# EAGLE design ClockDelay (EAGLE 6.6.0)
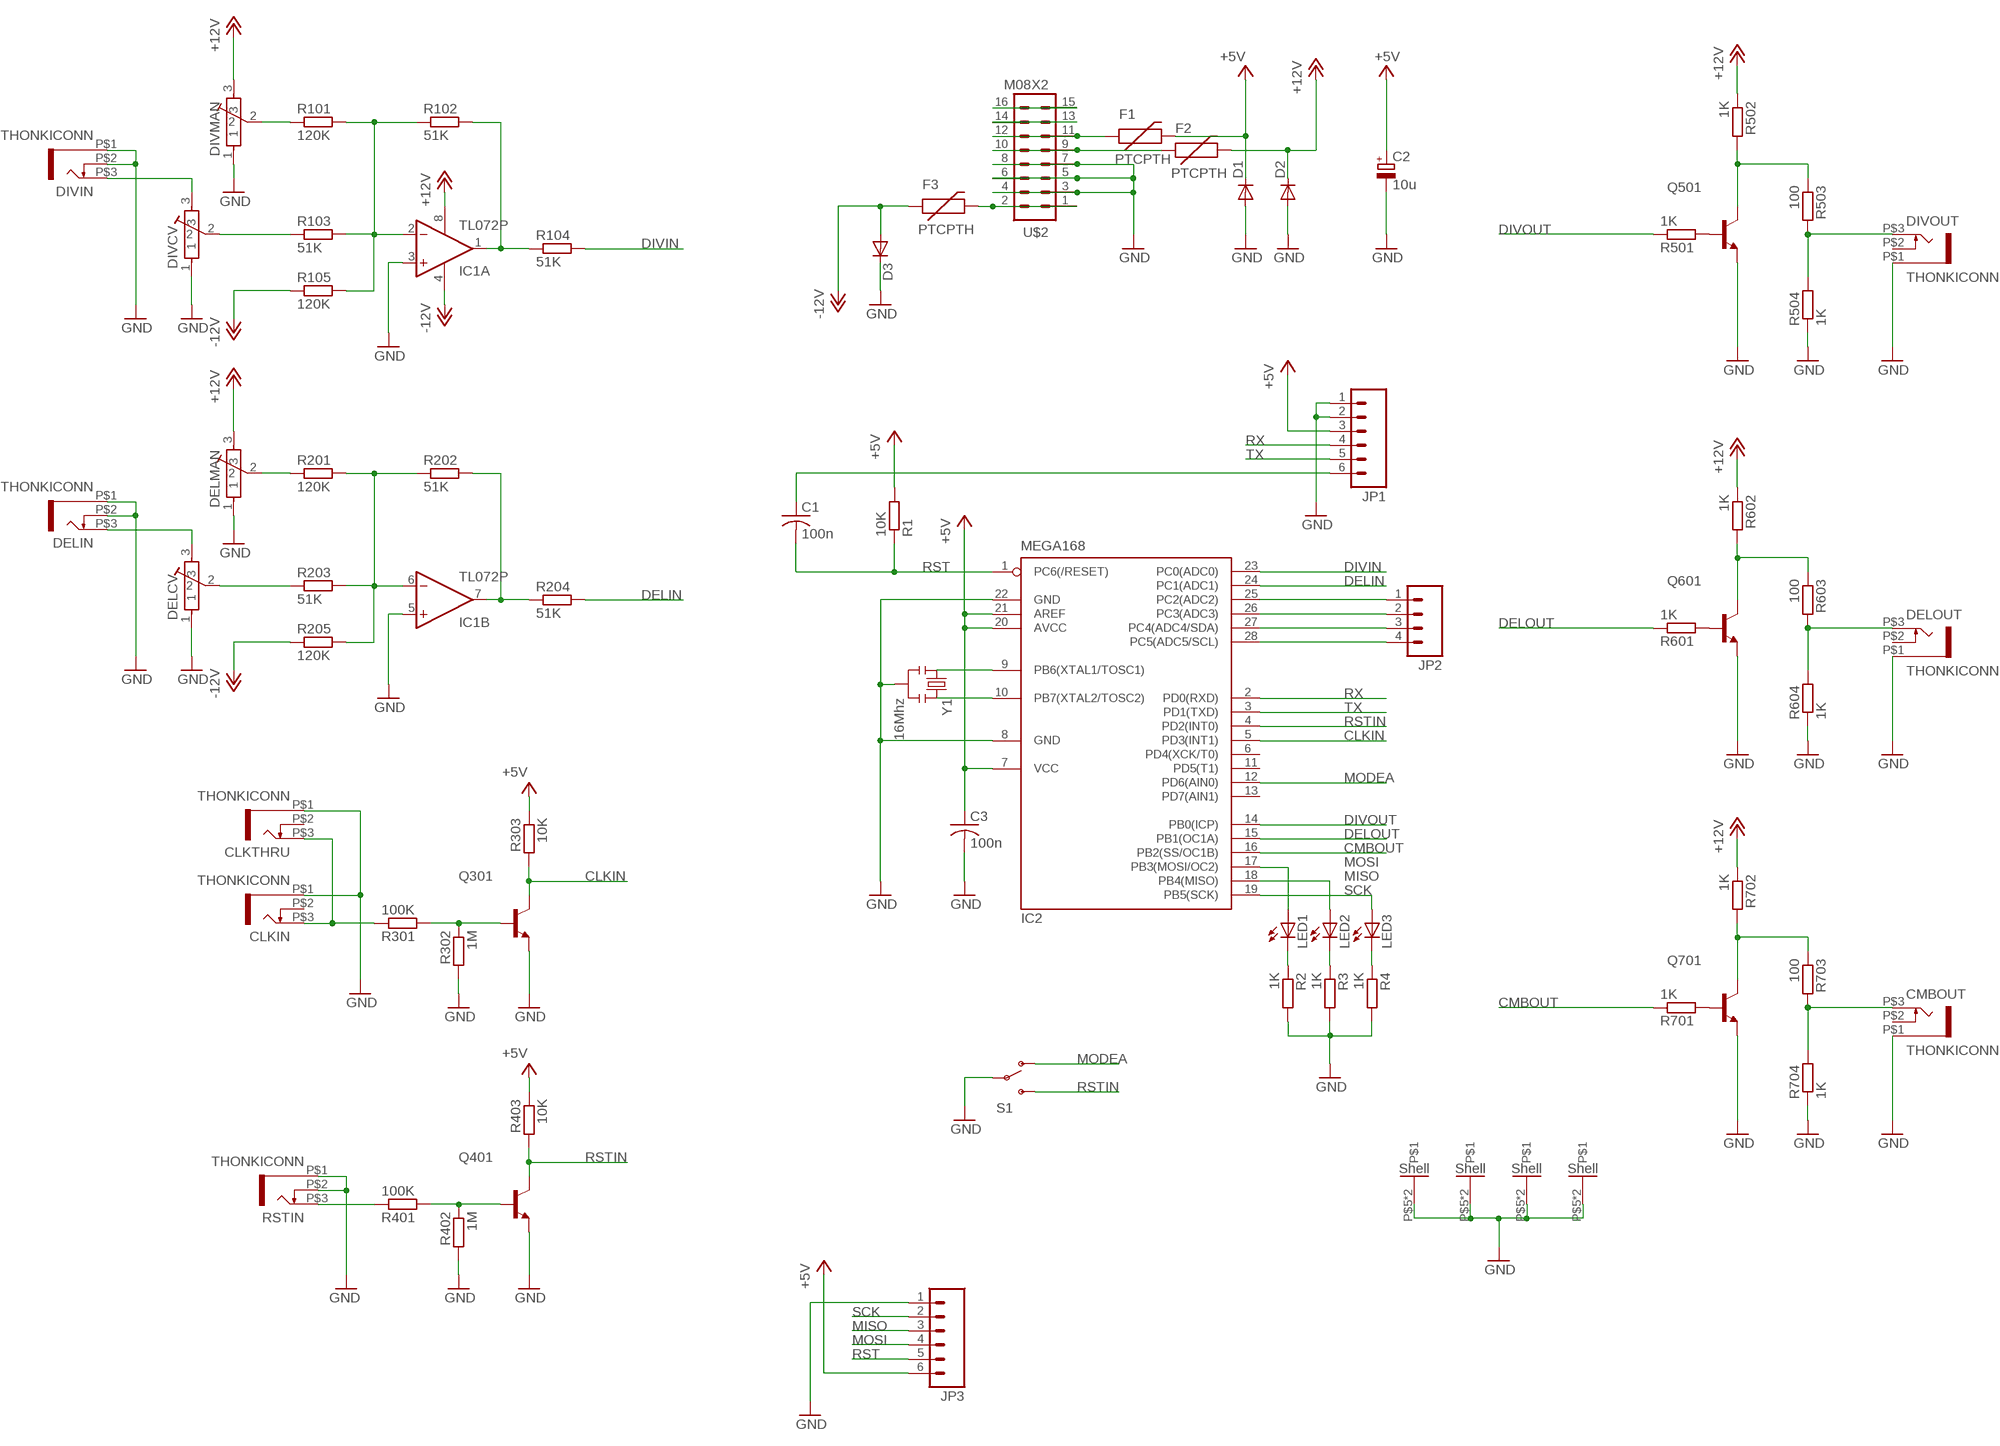
[diagram p0: schematic, sheet 1]

## Parts
C1  100n  C-US050-024X044  [C050-024X044]
C2  10u  CPOL-EUE5-6  [E5-6]
C3  100n  C-US050-024X044  [C050-024X044]
CLKIN  THONKICONN  [THONKICONN]
CLKTHRU  THONKICONN  [THONKICONN]
CMBOUT  THONKICONN  [THONKICONN]
D1  DIODE1N4001  [DIODE-1N4001]
D2  DIODE1N4001  [DIODE-1N4001]
D3  DIODE1N4001  [DIODE-1N4001]
DELCV  POT-ALPS-RK09L1140  [POT-ALPS-RK09L1140]
DELIN  THONKICONN  [THONKICONN]
DELMAN  POT-ALPS-RK09L1140  [POT-ALPS-RK09L1140]
DELOUT  THONKICONN  [THONKICONN]
DIVCV  POT-ALPS-RK09L1140  [POT-ALPS-RK09L1140]
DIVIN  THONKICONN  [THONKICONN]
DIVMAN  POT-ALPS-RK09L1140  [POT-ALPS-RK09L1140]
DIVOUT  THONKICONN  [THONKICONN]
F1  PTCPTH  [PTC]
F2  PTCPTH  [PTC]
F3  PTCPTH  [PTC]
IC1  TL072P  [DIL08]
IC2  MEGA168  MEGA8-P  [DIL28-3]
JP1  M06SIP  [1X06]
JP2  M04PTH  [1X04]
JP3  M06SIP  [1X06]
LED1  LED3MM  [LED3MM]
LED2  LED3MM  [LED3MM]
LED3  LED3MM  [LED3MM]
Q301  2N3904-NPN-TO92-EBC  [TO92-EBC]
Q401  2N3904-NPN-TO92-EBC  [TO92-EBC]
Q501  2N3904-NPN-TO92-EBC  [TO92-EBC]
Q601  2N3904-NPN-TO92-EBC  [TO92-EBC]
Q701  2N3904-NPN-TO92-EBC  [TO92-EBC]
R1  10K  R-EU_0204/7  [0204/7]
R2  1K  R-EU_0204/7  [0204/7]
R3  1K  R-EU_0204/7  [0204/7]
R4  1K  R-EU_0204/7  [0204/7]
R101  120K  R-EU_0204/7  [0204/7]
R102  51K  R-EU_0204/7  [0204/7]
R103  51K  R-EU_0204/7  [0204/7]
R104  51K  R-EU_0204/7  [0204/7]
R105  120K  R-EU_0204/7  [0204/7]
R201  120K  R-EU_0204/7  [0204/7]
R202  51K  R-EU_0204/7  [0204/7]
R203  51K  R-EU_0204/7  [0204/7]
R204  51K  R-EU_0204/7  [0204/7]
R205  120K  R-EU_0204/7  [0204/7]
R301  100K  R-EU_0204/7  [0204/7]
R302  1M  R-EU_0204/7  [0204/7]
R303  10K  R-EU_0204/7  [0204/7]
R401  100K  R-EU_0204/7  [0204/7]
R402  1M  R-EU_0204/7  [0204/7]
R403  10K  R-EU_0204/7  [0204/7]
R501  1K  R-EU_0204/7  [0204/7]
R502  1K  R-EU_0204/7  [0204/7]
R503  100  R-EU_0204/7  [0204/7]
R504  1K  R-EU_0204/7  [0204/7]
R601  1K  R-EU_0204/7  [0204/7]
R602  1K  R-EU_0204/7  [0204/7]
R603  100  R-EU_0204/7  [0204/7]
R604  1K  R-EU_0204/7  [0204/7]
R701  1K  R-EU_0204/7  [0204/7]
R702  1K  R-EU_0204/7  [0204/7]
R703  100  R-EU_0204/7  [0204/7]
R704  1K  R-EU_0204/7  [0204/7]
RSTIN  THONKICONN  [THONKICONN]
S1  SWITCH-SPST  [SWITCH-SPDT-SALECOM-T8014]
U$2  M08X2  [2X8]
Y1  16Mhz  RESONATORPTH  [RESONATOR-PTH]

## Nets
+5V: C2.+ C3.1 D1.C F1.P$2 IC2.7(VCC) IC2.20(AVCC) IC2.21(AREF) JP1.3 JP3.6 R1.2 R303.1 R403.1
+12V: D2.C DELMAN.3 DIVMAN.3 F2.P$2 IC1.8(P:V+) R502.1 R602.1 R702.1
-12V: D3.A F3.P$1 IC1.4(P:V-) R105.1 R205.1
CLKIN: IC2.5(PD3(INT1)) Q301.C R303.2
CMBOUT: IC2.16(PB2(SS/OC1B)) R701.1
DELIN: IC2.24(PC1(ADC1)) R204.2
DELOUT: IC2.15(PB1(OC1A)) R601.1
DIVIN: IC2.23(PC0(ADC0)) R104.2
DIVOUT: IC2.14(PB0(ICP)) R501.1
GND: C2.- C3.2 CLKIN.P$1 CLKTHRU.P$1 CMBOUT.P$1 D1.A D2.A D3.C DELCV.1 DELCV.P$5 DELCV.P$6 DELIN.P$1 DELIN.P$2 DELMAN.1 DELMAN.P$5 DELMAN.P$6 DELOUT.P$1 DIVCV.1 DIVCV.P$5 DIVCV.P$6 DIVIN.P$1 DIVIN.P$2 DIVMAN.1 DIVMAN.P$5 DIVMAN.P$6 DIVOUT.P$1 IC1.3(A:+IN) IC1.5(B:+IN) IC2.8(GND) IC2.22(GND) JP1.1 JP1.2 JP3.1 Q301.E Q401.E Q501.E Q601.E Q701.E R2.2 R3.2 R4.2 R302.2 R402.2 R504.1 R604.1 R704.1 RSTIN.P$1 RSTIN.P$2 S1.2(P) U$2.3 U$2.4 U$2.5 U$2.6 U$2.7 U$2.8 Y1.2
MISO: IC2.18(PB4(MISO)) JP3.3 LED2.A
MODEA: IC2.12(PD6(AIN0)) S1.1(O)
MOSI: IC2.17(PB3(MOSI/OC2)) JP3.4 LED1.A
N$1: DIVCV.3 DIVIN.P$3
N$2: IC1.2(A:-IN) R101.2 R102.1 R103.2 R105.2
N$3: DIVMAN.2 R101.1
N$4: IC1.1(A:OUT) R102.2 R104.1
N$5: DIVCV.2 R103.1
N$6: F3.P$2 U$2.1 U$2.2
N$7: IC1.6(B:-IN) R201.2 R202.1 R203.2 R205.2
N$8: DELMAN.2 R201.1
N$9: IC1.7(B:OUT) R202.2 R204.1
N$10: DELCV.2 R203.1
N$11: IC2.25(PC2(ADC2)) JP2.1
N$12: DELCV.3 DELIN.P$3
N$13: IC2.26(PC3(ADC3)) JP2.2
N$14: IC2.27(PC4(ADC4/SDA)) JP2.3
N$15: IC2.28(PC5(ADC5/SCL)) JP2.4
N$20: IC2.9(PB6(XTAL1/TOSC1)) Y1.1
N$21: IC2.10(PB7(XTAL2/TOSC2)) Y1.3
N$23: LED1.K(C) R2.1
N$24: LED2.K(C) R3.1
N$25: LED3.K(C) R4.1
N$26: Q601.B R601.2
N$27: Q301.B R301.2 R302.1
N$28: CLKIN.P$3 CLKTHRU.P$3 R301.1
N$29: C1.1 JP1.6
N$30: DELOUT.P$3 R603.2 R604.2
N$31: Q401.B R401.2 R402.1
N$32: Q601.C R602.2 R603.1
N$33: Q501.B R501.2
N$34: Q701.B R701.2
N$35: CMBOUT.P$3 R703.2 R704.2
N$36: DIVOUT.P$3 R503.2 R504.2
N$37: Q501.C R502.2 R503.1
N$38: Q701.C R702.2 R703.1
N$40: R401.1 RSTIN.P$3
N$43: U$2.13 U$2.14
N$44: F1.P$1 U$2.11 U$2.12
N$45: F2.P$1 U$2.9 U$2.10
PWR_BUS: U$2.15 U$2.16
RST: C1.2 IC2.1(PC6(/RESET)) JP3.5 R1.1
RSTIN: IC2.4(PD2(INT0)) Q401.C R403.2 S1.3(S)
RX: IC2.2(PD0(RXD)) JP1.4
SCK: IC2.19(PB5(SCK)) JP3.2 LED3.A
TX: IC2.3(PD1(TXD)) JP1.5
Unconnected: CLKIN.P$2 CLKTHRU.P$2 CMBOUT.P$2 DELOUT.P$2 DIVOUT.P$2 IC2.6(PD4(XCK/T0)) IC2.11(PD5(T1)) IC2.13(PD7(AIN1))

## Library data of the parts
C1 C3 = rcl:C-US: CAPACITOR, American symbol
C2 = rcl:CPOL-EU: POLARIZED CAPACITOR, European symbol
CLKIN CLKTHRU CMBOUT DELIN DELOUT DIVIN DIVOUT RSTIN = Rebel:THONKICONN
D1-D3 = Rebel:DIODE: Diode
DELCV DELMAN DIVCV DIVMAN = Rebel:POT-ALPS-RK09L
F1-F3 = Rebel:PTC: Resettable Fuse PTC
IC1 = linear:TL072: OP AMP
IC2 = atmel:MEGA8-P: MICROCONTROLLER 8 Kbytes FLASH, 1 kbytes SRAM, 512 bytes EEPROM, USART, 4-channel 10 bit ADC, 2-channel 8 bit ADC Pin compatible with Atmega48, ATMega88, ATMega168 Source: avr.lbr; OC_FARNELL: unknown; OC_NEWARK: unknown
JP1 JP3 = SparkFun:M06: Header 6 Standard 6-pin 0.1" header. Use with straight break away headers (SKU : PRT-00116), right angle break away headers (PRT-00553), swiss pins (PRT-00743), machine pins (PRT-00117), and female headers (PRT-00115). Molex polarized connector foot print use with SKU : PRT-08094 with associated crimp pins and housings. NOTES ON THE VARIANTS LOCK and LOCK_LONGPADS... This footprint was designed to help hold the alignment of a through-hole component (i.e. 6-pin header) while soldering it into place. You may notice that each hole has been shifted either up or down by 0.005 of an inch from it's more standard position (which is a perfectly straight line). This slight alteration caused the pins (the squares in the middle) to touch the edges of the holes. Because they are alternating, it causes a "brace" to hold the component in place. 0.005 has proven to be the perfect amount of "off-center" position when using our standard breakaway headers. Although looks a little odd when you look at the bare footprint, once you have a header in there, the alteration is very hard to notice. Also, if you push a header all the way into place, it is covered up entirely on the bottom side. This idea of altering the position of holes to aid alignment will be further integrated into the Sparkfun Library for other footprints. It can help hold any component with 3 or more connection pins.
JP2 = SparkFun:M04: Header 4 Standard 4-pin 0.1" header. Use with straight break away headers (SKU : PRT-00116), right angle break away headers (PRT-00553), swiss pins (PRT-00743), machine pins (PRT-00117), and female headers (PRT-00115). Molex polarized connector foot print use with SKU : PRT-08231 with associated crimp pins and housings. 1MM SMD Version SKU: PRT-10208
LED1-LED3 = Rebel:LED: LED OSRAM: - CHIPLED LG R971, LG N971, LY N971, LG Q971, LY Q971, LO R971, LY R971 LH N974, LH R974 LS Q976, LO Q976, LY Q976 LO Q996 - Hyper CHIPLED LW Q18S LB Q993, LB Q99A, LB R99A - SideLED LS A670, LO A670, LY A670, LG A670, LP A670 LB A673, LV A673, LT A673, LW A673 LH A674 LY A675 LS A676, LA A676, LO A676, LY A676, LW A676 LS A679, LY A679, LG A679 - Hyper Micro SIDELED® LS Y876, LA Y876, LO Y876, LY Y876 LT Y87S - SmartLED LW L88C, LW L88S LB L89C, LB L89S, LG L890 LS L89K, LO L89K, LY L89K LS L896, LA L896, LO L896, LY L896 - TOPLED LS T670, LO T670, LY T670, LG T670, LP T670 LSG T670, LSP T670, LSY T670, LOP T670, LYG T670 LG T671, LOG T671, LSG T671 LB T673, LV T673, LT T673, LW T673 LH T674 LS T676, LA T676, LO T676, LY T676, LB T676, LH T676, LSB T676, LW T676 LB T67C, LV T67C, LT T67C, LS T67K, LO T67K, LY T67K, LW E67C LS E67B, LA E67B, LO E67B, LY E67B, LB E67C, LV E67C, LT E67C LW T67C LS T679, LY T679, LG T679 LS T770, LO T770, LY T770, LG T770, LP T770 LB T773, LV T773, LT T773, LW T773 LH T774 LS E675, LA E675, LY E675, LS T675 LS T776, LA T776, LO T776, LY T776, LB T776 LHGB T686 LT T68C, LB T68C - Hyper Mini TOPLED® LB M676 - Mini TOPLED Santana® LG M470 LS M47K, LO M47K, LY M47K Source: http://www.osram.convergy.de LUXEON: - LUMILED® LXK2-PW12-R00, LXK2-PW12-S00, LXK2-PW14-U00, LXK2-PW14-V00 LXK2-PM12-R00, LXK2-PM12-S00, LXK2-PM14-U00 LXK2-PE12-Q00, LXK2-PE12-R00, LXK2-PE12-S00, LXK2-PE14-T00, LXK2-PE14-U00 LXK2-PB12-K00, LXK2-PB12-L00, LXK2-PB12-M00, LXK2-PB14-N00, LXK2-PB14-P00, LXK2-PB14-Q00 LXK2-PR12-L00, LXK2-PR12-M00, LXK2-PR14-Q00, LXK2-PR14-R00 LXK2-PD12-Q00, LXK2-PD12-R00, LXK2-PD12-S00 LXK2-PH12-R00, LXK2-PH12-S00 LXK2-PL12-P00, LXK2-PL12-Q00, LXK2-PL12-R00 Source: www.luxeon.com KINGBRIGHT: KA-3528ASYC Source: www.kingbright.com
Q301 Q401 Q501 Q601 Q701 = transistor-neu-to92:*-NPN-: NPN Transistror
R1-R4 R101-R105 R201-R205 R301-R303 R401-R403 R501-R504 R601-R604 R701-R704 = Rebel:R-EU_: RESISTOR, European symbol
S1 = Rebel:SWITCH-SPST: SPST Switch Simple slide switch. Spark Fun Electronics SKU : COM-00102
U$2 = SparkFun:M08X2
Y1 = SparkFun:RESONATOR: Resonator Small SMD resonator. This is the itty bitty 10/20MHz resonators with built in caps. CSTCE10M0G55 and CSTCE20M0V53. Footprint has been reviewed closely but hasn't been tested yet.

## Board
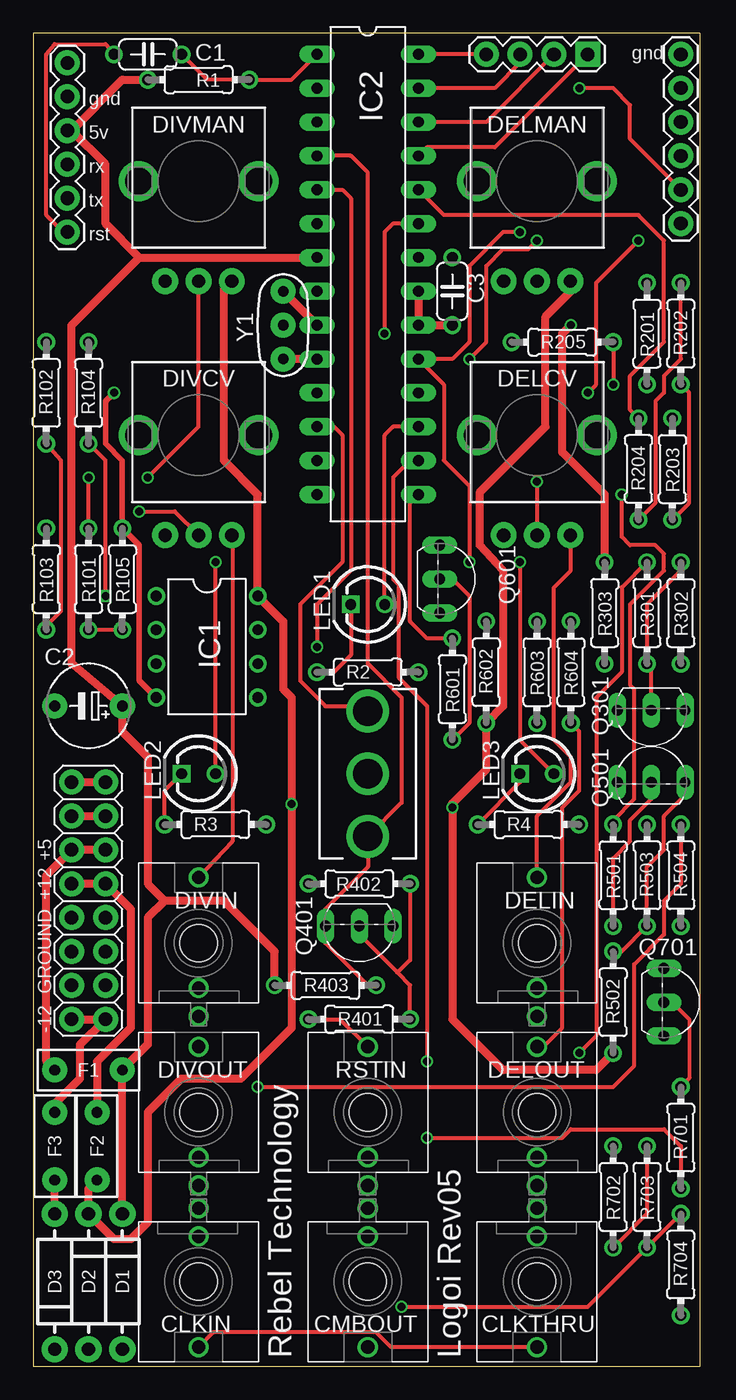
[diagram p1: board, top side]
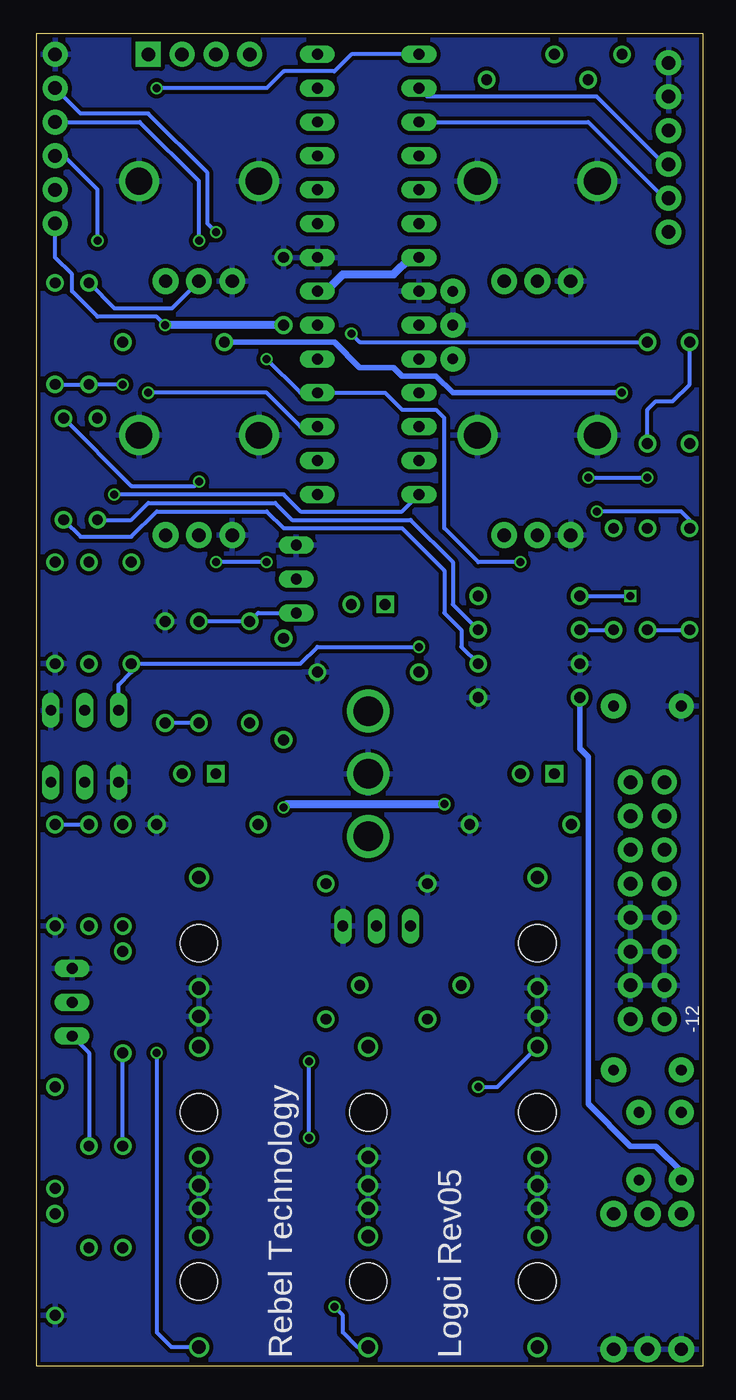
[diagram p2: board, bottom side, seen from below]

Size 50 x 100 mm. Coordinates in mm from the lower left corner, seen from the top.
Outline: 50,100 0,100 0,0 50,0 50,100
Copper layers (1*16): Top 0.035mm / dielectric 1.5mm / Bottom 0.035mm
Design rules "Fusion_eagle_rule_v1.1": minimum track width 6mil, minimum drill 12mil, track to track 6mil, track to pad 6mil, pad to pad 6mil, via to via 6mil, smd to smd 0mil, copper to edge 10mil, drill to drill 10mil, minimum pad ring 10mil, minimum via ring 6mil, stop-mask expansion 2mil, vias tented up to drill 100mil, thermal gap 10mil

### Footprints (pad centres in the part's own frame; a part is rotated, then mirrored left to right if it is on the bottom)
C050-024X044 = drill 0.813: 1 -2.54,0; 2 2.54,0
E5-6 = drill 0.813 pad 1.905: + -2.54,0; - 2.54,0
THONKICONN = drill 1: P$1 0,-5.5; P$2 0,-3.38; P$3 0,4.92 | hole 2.8: 0,0
DIODE-1N4001 = drill 1 pad 1.981: A -5.08,0; C 5.08,0
POT-ALPS-RK09L1140 = drill 1 pad 1.93: 1 -2.5,-7.5; 2 0,-7.5; 3 2.5,-7.5 | drill 2: P$5 -4.5,0; P$6 4.5,0
PTC = drill 0.8 pad 1.88: P$1 -2.54,0; P$2 2.54,0
DIL08 = drill 0.813 pad 1.27: 1 -3.81,-3.81; 2 -1.27,-3.81; 3 1.27,-3.81; 4 3.81,-3.81; 5 3.81,3.81; 6 1.27,3.81; 7 -1.27,3.81; 8 -3.81,3.81
DIL28-3 = drill 0.813 long: 1 -16.51,-3.81; 2 -13.97,-3.81; 3 -11.43,-3.81; 4 -8.89,-3.81; 5 -6.35,-3.81; 6 -3.81,-3.81; 7 -1.27,-3.81; 8 1.27,-3.81; 9 3.81,-3.81; 10 6.35,-3.81; 11 8.89,-3.81; 12 11.43,-3.81; 13 13.97,-3.81; 14 16.51,-3.81; 15 16.51,3.81; 16 13.97,3.81; 17 11.43,3.81; 18 8.89,3.81; 19 6.35,3.81; 20 3.81,3.81; 21 1.27,3.81; 22 -1.27,3.81; 23 -3.81,3.81; 24 -6.35,3.81; 25 -8.89,3.81; 26 -11.43,3.81; 27 -13.97,3.81; 28 -16.51,3.81
1X06 = drill 1.016 pad 1.88: 1 0,0; 2 2.54,0; 3 5.08,0; 4 7.62,0; 5 10.16,0; 6 12.7,0
1X04 = drill 1.016 pad 1.88 square: 1 0,0 | drill 1.016 pad 1.88: 2 2.54,0; 3 5.08,0; 4 7.62,0
LED3MM = drill 0.813: A -1.27,0 | drill 0.813 square: K 1.27,0
TO92-EBC = drill 0.813 long: B 0,-1.27; C 2.54,-1.27; E -2.54,-1.27
0204/7 = drill 0.813: 1 -3.81,0; 2 3.81,0
SWITCH-SPDT-SALECOM-T8014 = drill 2.2: 1 0,4.699; 2 0,0; 3 0,-4.699
2X8 = drill 1.016 pad 1.88: 1 0,0; 2 0,2.54; 3 2.54,0; 4 2.54,2.54; 5 5.08,0; 6 5.08,2.54; 7 7.62,0; 8 7.62,2.54; 9 10.16,0; 10 10.16,2.54; 11 12.7,0; 12 12.7,2.54; 13 15.24,0; 14 15.24,2.54; 15 17.78,0; 16 17.78,2.54
RESONATOR-PTH = drill 0.8 pad 1.88: 1 -2.54,0; 2 0,0; 3 2.54,0

### Placement (x,y rotation side)
C1  8.59,98.42 0 top
C2  4.15,49.53 180 top
C3  31.45,80.64 90 top
CLKIN  12.4,6.35 180 top
CLKTHRU  37.8,6.35 180 top
CMBOUT  25.1,6.35 180 top
D1  6.69,6.35 90 top
D2  4.15,6.35 90 top
D3  1.6,6.35 270 top
DELCV  37.8,69.85 0 top
DELIN  37.8,31.75 0 top
DELMAN  37.8,88.9 0 top
DELOUT  37.8,19.05 0 top
DIVCV  12.4,69.85 0 top
DIVIN  12.4,31.75 0 top
DIVMAN  12.4,88.9 0 top
DIVOUT  12.4,19.05 0 top
F1  4.15,22.23 0 top
F2  4.78,16.51 270 top
F3  1.6,16.51 90 top
IC1  13.04,53.98 270 top
IC2  25.1,81.92 270 top
JP1  2.56,97.79 270 top
JP2  41.61,98.42 180 top
JP3  48.6,98.42 270 top
LED1  25.1,57.15 180 top
LED2  12.4,44.45 180 top
LED3  37.8,44.45 180 top
Q301  46.37,47.94 180 top
Q401  24.46,31.75 180 top
Q501  46.37,45.09 0 top
Q601  31.77,59.05 270 top
Q701  48.6,27.3 270 top
R1  12.4,96.52 180 top
R2  25.1,52.07 0 top
R3  13.67,40.64 0 top
R4  37.17,40.64 0 top
R101  4.15,59.05 270 top
R102  0.97,73.03 90 top
R103  0.97,59.05 270 top
R104  4.15,73.03 90 top
R105  6.69,59.05 270 top
R201  46.05,77.47 270 top
R202  48.6,77.47 90 top
R203  47.96,67.31 270 top
R204  45.42,67.31 90 top
R205  39.71,76.83 0 top
R301  46.05,56.52 270 top
R302  48.6,56.52 270 top
R303  42.88,56.52 270 top
R401  24.46,26.04 0 top
R402  24.46,36.2 180 top
R403  21.93,28.57 0 top
R501  43.52,36.83 270 top
R502  43.52,27.3 90 top
R503  46.05,36.83 90 top
R504  48.6,36.83 90 top
R601  31.45,50.8 270 top
R602  33.99,52.07 90 top
R603  37.8,52.07 270 top
R604  40.34,52.07 270 top
R701  48.6,17.14 90 top
R702  43.52,12.7 270 top
R703  46.05,12.7 270 top
R704  48.6,7.62 90 top
RSTIN  25.1,19.05 0 top
S1  25.1,44.45 0 top
U$2  5.42,26.04 90 top
Y1  18.75,78.11 270 top

### Tracks (layer width: path | path; a pad name or v marks a point on that pad's centre or on a via)
+5V  (via drill 0.6)
  Top 0.61: IC2.21 IC2.20 C3.1 | R303.1 42.88,65.41 39.71,68.58 39.71,77.47 v40.34,78.11 | 2.88,92.71 5.42,90.17 5.42,85.72 7.96,83.19 | JP1.3 2.88,92.71 | 2.88,92.71 6.69,96.52 R1.2 | D1.C F1.P$2 8.59,24.13 8.59,33.66 9.86,34.92 | 7.96,83.19 2.88,78.11 2.88,52.7 C2.+ 6.69,47.62 8.59,45.72 8.59,36.2 9.86,34.92 | 7.96,83.19 IC2.7 | R403.1 18.11,31.11 14.3,34.92 9.86,34.92
  Bottom 0.305: v40.34,78.11 40.98,78.74 45.42,78.74 47.33,80.64 47.33,81.92 48.6,83.19 JP3.6
  Bottom 0.61: IC2.21 28.27,80.64 27,81.92 23.2,81.92 21.93,83.19 IC2.7 | C3.1 v40.34,78.11
+12V  (via drill 0.6)
  Top 0.61: R502.1 42.25,22.23 35.26,22.23 31.45,26.04 v31.45,41.91 31.45,42.23 33.99,44.77 R602.1 35.26,49.53 35.26,59.69 33.48,61.59 33.48,65.53 38.44,70.48 38.44,78.74 40.34,80.64 40.34,81.36 DELMAN.3 | F2.P$2 4.15,13.34 D2.C 6.05,9.53 7.32,9.53 8.59,10.79 8.59,19.05 11.13,21.59 15.57,21.59 19.38,25.4 v19.38,42.16 19.38,50.16 18.75,50.8 18.75,55.88 IC1.8 16.84,65.41 14.3,67.94 14.3,80.81 DIVMAN.3
  Bottom 0.305: R702.1 R502.1
  Bottom 0.61: v19.38,42.16 31.2,42.16 v31.45,41.91
-12V  (via drill 0.6)
  Top 0.406: IC1.4 7.96,51.44 7.96,61.59 R105.1 6.69,67.94 5.42,69.22 5.42,72.39 v6.05,73.03
  Top 0.61: D3.A F3.P$1
  Bottom 0.406: F3.P$1 1.6,14.61 3.51,16.51 5.42,16.51 8.59,19.68 8.59,45.72 9.22,46.35 IC1.4 | R205.1 27.64,76.83 25.73,74.93 23.2,74.93 22.56,74.3 20.02,74.3 18.75,73.03 v6.05,73.03
CLKIN  (via drill 0.6)
  Top 0.305: IC2.5 23.2,88.27 23.83,87.63 23.83,59.69 21.29,57.15 v21.29,53.98
  Bottom 0.305: v21.29,53.98 28.91,53.98 30.18,52.7 R303.2 42.88,52.07 43.83,51.12 Q301.C
CMBOUT  (via drill 0.6)
  Top 0.305: IC2.16 28.27,67.94 27,66.67 27,59.05 27.45,58.61 27.45,51.63 29.54,49.53 v29.54,22.86 | v29.54,17.14 39.71,17.14 40.34,17.78 47.33,17.78 48.6,16.51 R701.1
  Bottom 0.305: v29.54,17.14 v29.54,22.86
DELIN
  Top 0.305: IC2.24 30.81,86.36 45.42,86.36 47.33,84.45 47.33,76.83 44.79,74.3 44.79,71.75 R204.2
DELOUT
  Top 0.305: R601.1 29.54,54.61 28.27,55.88 28.27,64.77 IC2.15
DIVIN  (via drill 0.6)
  Top 0.305: IC2.23 27,85.72 26.37,85.09 v26.37,77.47
  Bottom 0.305: v26.37,77.47 25.73,76.83 R104.2
DIVOUT  (via drill 0.6)
  Top 0.305: v44.15,65.41 44.15,62.23 44.79,61.59 46.69,61.59 47.33,60.96 47.33,59.69 44.79,57.15 44.79,51.12 45.1,50.8 45.1,42.55 43.52,40.96 R501.1
  Bottom 0.305: v44.15,65.41 31.45,65.41 30.18,64.14 22.56,64.14 IC2.14
GND
  pour Bottom (isolate 0.305): 50.5,0 -0.3,0 -0.3,100.33 50.5,100.33
MISO  (via drill 0.6)
  Top 0.305: LED2.A v13.67,60.33 | v32.72,75.56 33.99,76.83 33.99,82.55 35.26,83.82 37.17,83.82 v37.8,84.45
  Bottom 0.305: v13.67,60.33 16.84,60.33 19.38,62.87 19.38,71.12 20.02,71.75 22.56,71.75 23.83,73.03 IC2.18 30.18,73.03 v32.72,75.56 | JP3.3 42.25,93.34 37.8,88.9 v37.8,84.45
MODEA
  Top 0.305: IC2.12 22.56,70.48 23.2,69.85 23.2,60.33 20.02,57.15 20.02,51.44 21.93,49.53 24.72,49.53 S1.1
MOSI  (via drill 0.6)
  Top 0.305: IC2.17 27,70.48 26.37,69.85 LED1.A | v41.61,73.03 42.25,73.66 42.25,81.28 v45.42,84.45
  Bottom 0.305: JP3.4 47.96,90.81 45.42,88.27 v45.42,84.45 | IC2.17 30.18,70.48 32.72,73.03 v41.61,73.03
N$1
  Top 0.305: DIVCV.3 14.94,62.31 14.94,39.37 DIVIN.P$3
N$2
  Top 0.305: R102.1 2.09,67.94 2.09,56.64 0.97,55.52 R103.2 | R105.2 R101.2
  Bottom 0.305: R101.2 R103.2 | IC1.2 R105.2
N$3  (via drill 0.6)
  Top 0.305: R101.1 v4.15,66.67 | v8.59,66.67 12.4,70.48 DIVMAN.2
  Bottom 0.305: v8.59,66.67 v4.15,66.67
N$4  (via drill 0.6)
  Top 0.305: v5.42,57.78 5.42,67.94 R104.1
  Bottom 0.305: IC1.1 v5.42,57.78 | R104.1 4.15,71.75 3.51,72.39 2.24,72.39 0.97,73.66 R102.2
N$5  (via drill 0.6)
  Top 0.305: v7.96,64.14 10.61,64.14 DIVCV.2
  Bottom 0.305: R103.1 0.97,63.5 1.6,64.14 v7.96,64.14
N$6
  Top 0.61: U$2.2 U$2.1 3.51,24.13 3.51,21.59 1.6,19.68 F3.P$2
N$7  (via drill 0.6)
  Top 0.305: R203.2 49.23,64.77 49.23,73.03 R202.1 | R205.2 v43.52,73.66
  Bottom 0.305: R203.2 46.69,62.23 42.88,62.23 40.98,64.14 32.72,64.14 31.45,62.87 22.56,62.87 19.38,59.69 19.38,56.52 18.11,55.24 18.11,53.98 IC1.6 | R202.1 R201.2 v43.52,73.66
N$8
  Bottom 0.305: R201.1 44.15,79.38 39.83,79.38 DELMAN.2
N$9
  Top 0.305: R204.1 46.69,64.77 46.69,72.39 47.33,73.03 47.33,74.3 48.6,75.56 R202.2
  Bottom 0.305: R204.1 42.88,63.5 41.61,64.77 32.09,64.77 30.81,63.5 21.93,63.5 18.75,60.33 18.75,57.15 IC1.7
N$10  (via drill 0.6)
  Top 0.305: v37.8,66.36 DELCV.2
  Bottom 0.305: R203.1 42.88,66.04 38.12,66.04 v37.8,66.36
N$11
  Top 0.305: JP2.1 34.62,91.44 29.54,91.44 IC2.25
N$12
  Top 0.305: DELCV.3 40.34,62.31 40.34,59.69 39.07,58.42 39.07,46.99 40.34,45.72 40.34,43.81 37.8,41.27 DELIN.P$3
N$13
  Top 0.305: JP2.2 33.99,93.34 IC2.26
N$14
  Top 0.305: JP2.3 36.53,97.79 34.62,95.89 IC2.27
N$15
  Top 0.305: JP2.4 IC2.28
N$20
  Top 0.61: IC2.9 Y1.1
N$21
  Top 0.61: IC2.10 Y1.3
N$23
  Top 0.305: LED1.K 23.83,53.34 22.56,52.07 R2.1
N$24
  Top 0.305: R3.1 9.86,43.18 LED2.K
N$25
  Top 0.305: LED3.K 36.53,43.81 R4.1
N$26
  Top 0.305: Q601.B 31.45,59.05 32.72,57.78 32.72,48.26 R601.2
N$27
  Top 0.305: R302.1 48.6,59.69 46.05,57.15 R301.2 46.37,52.39 Q301.B
N$28  (via drill 0.6)
  Top 0.305: R301.1 44.15,58.42 44.15,52.07 42.25,50.16 42.25,24.77 v40.98,23.5 | CLKTHRU.P$3 26.84,1.43 25.73,2.54 13.51,2.54 CLKIN.P$3
  Bottom 0.305: v40.98,23.5 40.98,2.54 39.87,1.43 CLKTHRU.P$3
N$29
  Top 0.305: JP1.6 2.24,85.09 0.97,86.36 0.97,98.42 1.6,99.19 5.42,99.19 C1.1
N$30
  Top 0.305: DELOUT.P$3 38.28,23.97 39.71,25.4 39.71,41.91 40.98,43.18 40.98,47.62 R604.2
  Bottom 0.305: R603.2 R604.2
N$31
  Top 0.305: R401.2 28.27,28.57 27.32,29.53 | R402.1 28.27,30.48 27.32,29.53 | Q401.B 24.46,32.38 27.32,29.53
N$32
  Bottom 0.305: Q601.C 33.36,56.52 R602.2 R603.1
N$33
  Top 0.305: R501.2 43.52,38.1 44.79,39.37 44.79,40.96 46.37,42.55 Q501.B
N$34
  Top 0.305: Q701.B 47.96,27.3 49.23,26.04 49.23,21.59 R701.2
N$35  (via drill 0.6)
  Top 0.305: v27.64,4.45 41.61,4.45 R703.2 R704.2
  Bottom 0.305: CMBOUT.P$3 25.89,1.43 27,2.54 27,3.81 v27.64,4.45
N$36  (via drill 0.6)
  Top 0.305: v16.84,20.95 43.52,20.95 45.1,22.54 45.1,30.16 47.33,32.38 47.33,34.92 48.6,36.2 R504.2
  Bottom 0.305: R504.2 R503.2 | v16.84,20.95 15.41,20.95 DIVOUT.P$3
N$37
  Top 0.305: Q501.C 48.91,42.86 47.33,41.27 47.33,38.73 46.05,37.47 R503.1 44.15,31.11 R502.2
N$38
  Top 0.305: R703.1 46.05,11.43 R702.2
  Bottom 0.305: Q701.C 46.05,23.5 R703.1
N$40
  Top 0.305: R401.1 23.04,26.04 RSTIN.P$3
N$43
  Top 0.61: U$2.14 U$2.13
N$44
  Top 0.61: U$2.11 U$2.12 0.97,36.83 0.97,22.86 F1.P$1
N$45
  Top 0.61: U$2.10 U$2.9 7.32,34.29 7.32,25.4 4.78,22.86 F2.P$1
PWR_BUS
  Top 0.61: U$2.16 U$2.15
RST  (via drill 0.6)
  Top 0.305: IC2.1 19.38,96.52 R1.1 13.04,96.52 C1.2 | v40.98,95.89 43.52,95.89 44.79,94.61 44.79,92.08 JP3.5
  Bottom 0.305: IC2.1 26.37,98.42 27.64,97.16 31.45,97.16 32.72,95.89 v40.98,95.89
RSTIN
  Top 0.305: IC2.4 23.83,90.81 25.1,89.53 25.1,52.7 27.64,50.16 27.64,42.29 S1.3 25.1,37.47 21.93,34.29 Q401.C 21.93,31.75 25.1,28.57 R403.2
RX
  Bottom 0.305: JP1.4 2.88,90.17 7.96,95.25 20.65,95.25 IC2.2
SCK  (via drill 0.6)
  Top 0.305: v32.72,60.33 32.72,66.04 30.81,67.94 30.81,73.66 IC2.19 31.45,75.56 32.72,76.83 32.72,82.55 35.26,85.09 v36.53,85.09 | v36.53,60.33 36.53,46.99 LED3.A
  Bottom 0.305: v32.72,60.33 v36.53,60.33 | v36.53,85.09 37.17,85.72 37.17,89.53 41.61,93.98 46.69,93.98 JP3.2
TX
  Bottom 0.305: IC2.3 8.59,93.34 2.88,87.63 JP1.5

### Text on the board
tPlace: gnd | gnd | 5v | rx | tx | rst | +5 | +12 | GROUND | -12 | Rebel Technology | Logoi Rev05
bPlace: -12 | Logoi Rev05 | Rebel Technology
tNames: Y1